# EAGLE design bttoken (EAGLE 6.4)
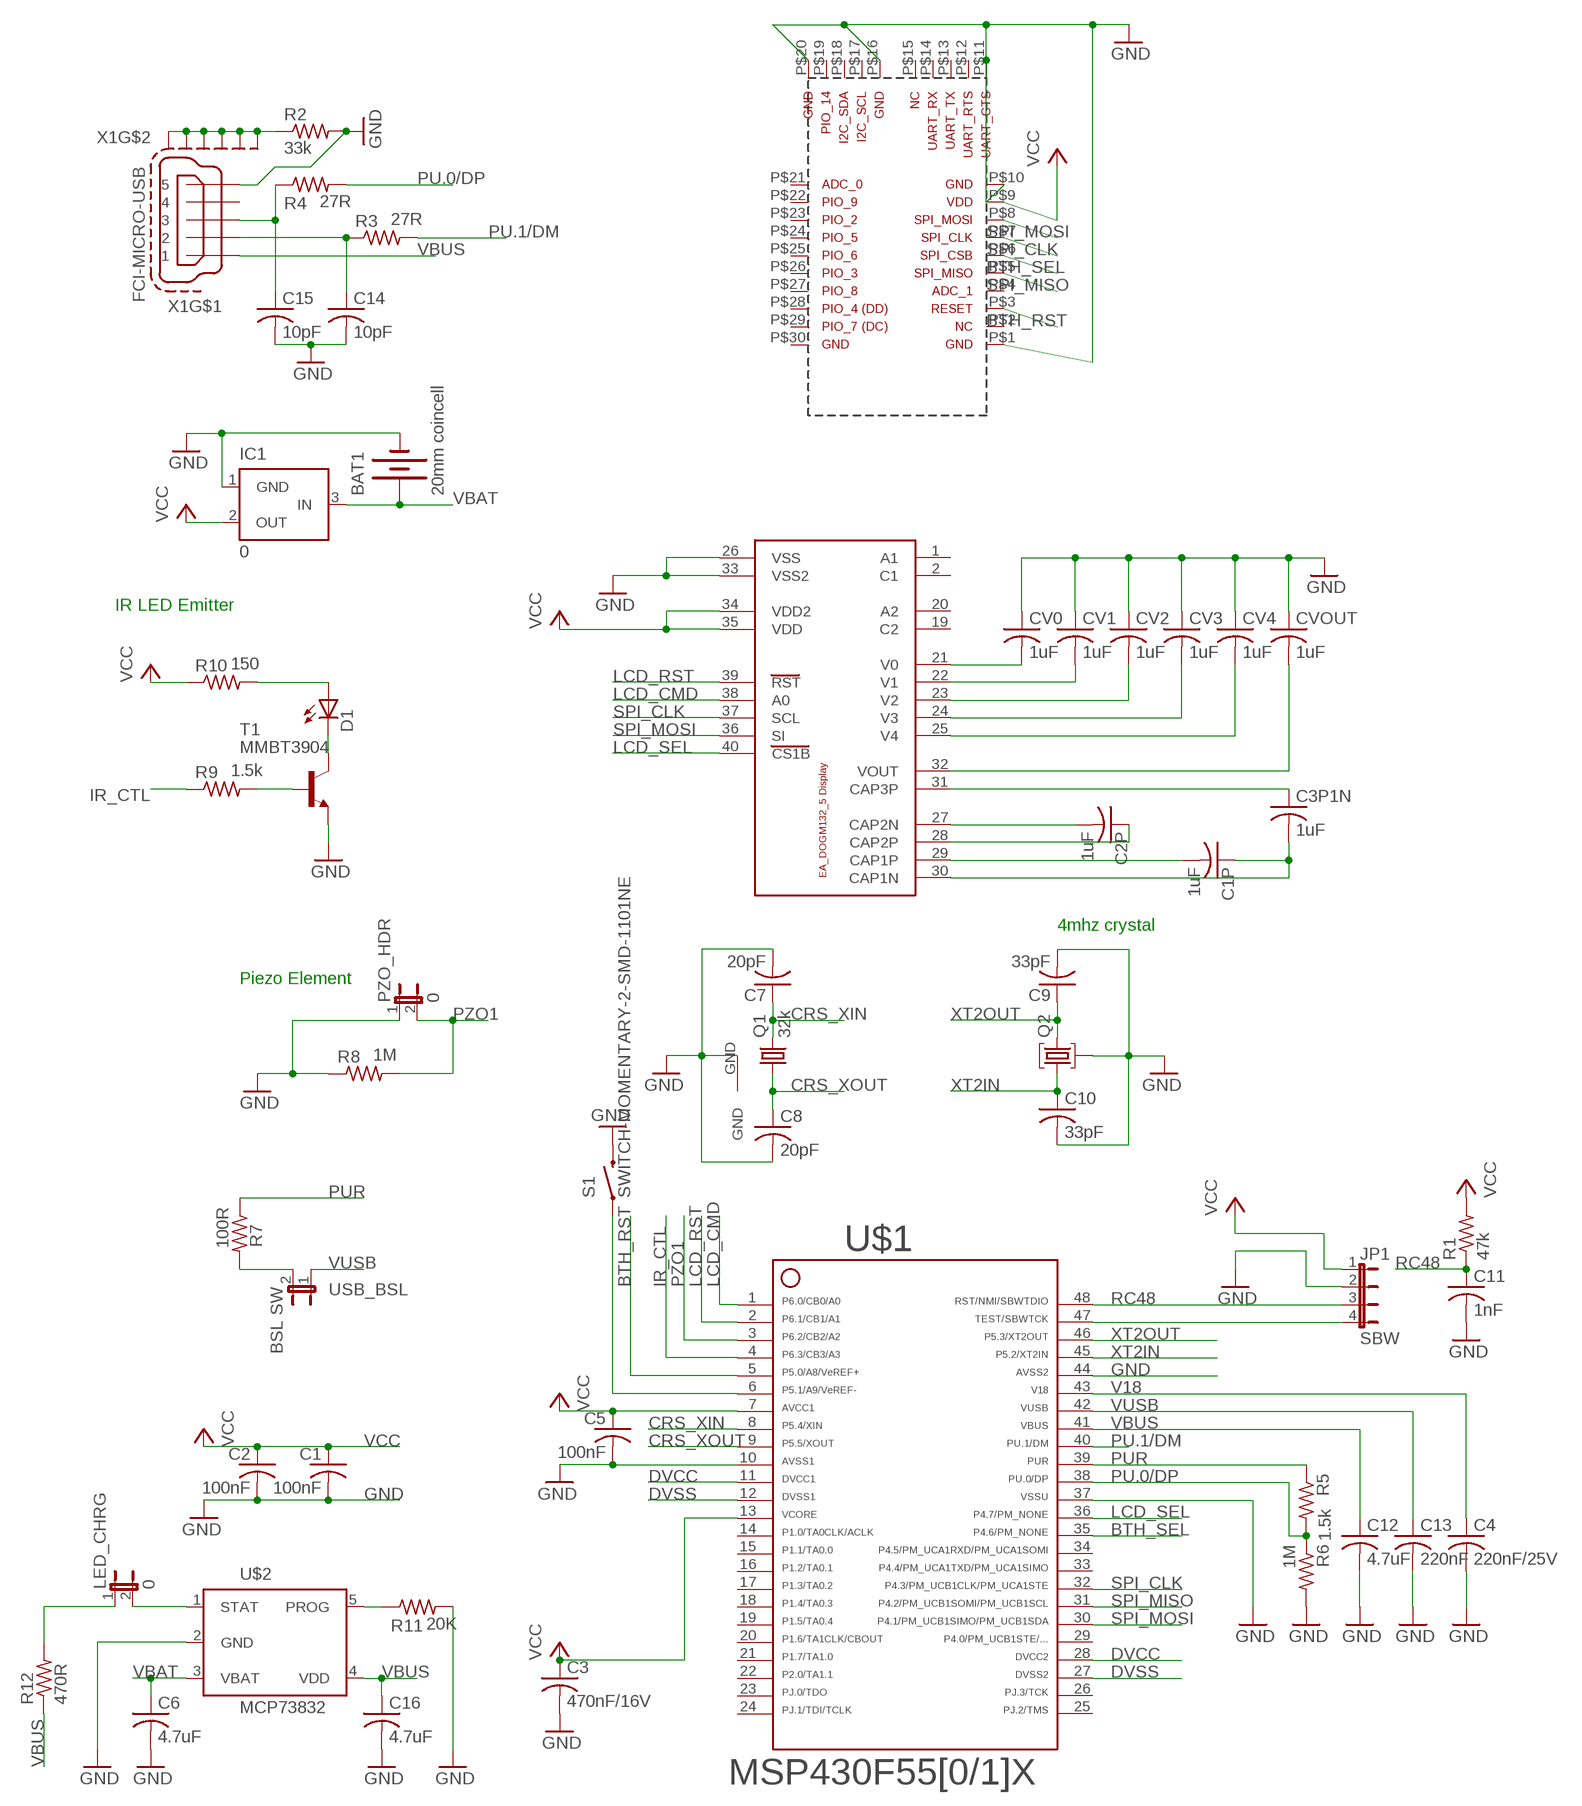
[diagram p0: schematic, sheet 1]

## Parts
BAT1  20mm coincell  BAT-HLD-001  [BAT-HLD-001]
C1  100nF  C-USC0805  [C0805]
C1P  1uF  C-USC0805  [C0805]
C2  100nF  C-USC0805  [C0805]
C2P  1uF  C-USC0805  [C0805]
C3  470nF/16V  C-USC0805  [C0805]
C3P1N  1uF  C-USC0805  [C0805]
C4  220nF/25V  C-USC0805  [C0805]
C5  100nF  C-USC0805  [C0805]
C6  4.7uF  C-USC0805  [C0805]
C7  20pF  C-USC0805  [C0805]
C8  20pF  C-USC0805  [C0805]
C9  33pF  C-USC0805  [C0805]
C10  33pF  C-USC0805  [C0805]
C11  1nF  C-USC0805  [C0805]
C12  4.7uF  C-USC0805  [C0805]
C13  220nF  C-USC0805  [C0805]
C14  10pF  C-USC0805  [C0805]
C15  10pF  C-USC0805  [C0805]
C16  4.7uF  C-USC0805  [C0805]
CV0  1uF  C-USC0805  [C0805]
CV1  1uF  C-USC0805  [C0805]
CV2  1uF  C-USC0805  [C0805]
CV3  1uF  C-USC0805  [C0805]
CV4  1uF  C-USC0805  [C0805]
CVOUT  1uF  C-USC0805  [C0805]
D1  SFH482  [SFH482]
IC1  0  MCP1700  [SOT23]
JP1  SBW  JMP4E  [JP4]
LED_CHRG  0  JP1E  [JP1]
PZO_HDR  0  JP1E  [JP1]
Q1  32k  TC47H-SMT  [TC26H-SMT]
Q2  10G7A-12.5KHZ  [HC49U]
R1  47k  R-US_R0805  [R0805]
R2  33k  R-US_R0805  [R0805]
R3  27R  R-US_R0805  [R0805]
R4  27R  R-US_R0805  [R0805]
R5  1.5k  R-US_R0805  [R0805]
R6  1M  R-US_R0805  [R0805]
R7  100R  R-US_R0805  [R0805]
R8  1M  R-US_R0805  [R0805]
R9  1.5k  R-US_R0805  [R0805]
R10  150  R-US_R0805  [R0805]
R11  20K  R-US_R0805  [R0805]
R12  470R  R-US_R0805  [R0805]
S1  SWITCH-MOMENTARY-2-SMD-1101NE  [TACTILE-SWITCH-1101NE]
T1  MMBT3904  MMBT3904LT1-NPN-SOT23-BEC  [SOT23-BEC]
U$1  F55[0/1]X---PT48  [PT48]
U$2  MCP73832  [SOT23-5]
U$11  DISPLAY_EA_DOGM132_EA_DOG-M_DISPLAY  [DISPLAY_EA_DOGM132_E_DOG-M_DISPLAY]
U$13  BR-LE4.0-S3-NC  [BR-LE4.0-X2A-NC]
USB_BSL  BSL SW  JP1E  [JP1]
X1  FCI-MICRO-USB  [FCI-MICRO-USB5]

## Nets
BTH_RST: U$1.5 U$13.P$3
BTH_SEL: U$1.35 U$13.P$6
CRS_XIN: C7.1 Q1.2 U$1.8
CRS_XOUT: C8.1 Q1.1 U$1.9
DVCC: U$1.11 U$1.28
DVSS: U$1.12 U$1.27
GND: BAT1.P$1-(-) C1.2 C2.2 C3.2 C4.2 C5.2 C6.2 C7.2 C8.2 C9.2 C10.2 C11.2 C12.2 C13.2 C14.2 C15.2 C16.2 CV0.1 CV1.1 CV2.1 CV3.1 CV4.1 CVOUT.1 IC1.1(GND) JP1.2 PZO_HDR.1 Q1.GND Q2.2 R2.2 R6.2 R8.1 R11.2 S1.P$2 T1.E U$1.10 U$1.37 U$1.44 U$2.2(GND) U$11.26(VSS) U$11.33(VSS2) U$13.P$1 U$13.P$10 U$13.P$11 U$13.P$16 U$13.P$20 X1.5
IR_CTL: R9.1 U$1.4
LCD_CMD: U$1.1 U$11.38(A0)
LCD_RST: U$1.2 U$11.39(RST)
LCD_SEL: U$1.36 U$11.40(CS1B)
N$1: R2.1 X1.M1(S1) X1.M2(S2) X1.M3(S3) X1.M4(S4) X1.M5(S5) X1.M6(S6)
N$2: R11.1 U$2.5(PROG)
N$3: LED_CHRG.2 U$2.1(STAT)
N$4: LED_CHRG.1 R12.2
N$5: D1.A R10.2
N$7: JP1.4 U$1.47
N$9: C14.1 R3.1 X1.2
N$10: R7.2 USB_BSL.2
N$11: CV1.2 U$11.22(V1)
N$12: R9.2 T1.B
N$13: C15.1 R4.1 X1.3
N$14: S1.P$1 U$1.6
N$15: D1.K(C) T1.C
N$16: CV2.2 U$11.23(V2)
N$17: CV3.2 U$11.24(V3)
N$18: CV4.2 U$11.25(V4)
N$19: CVOUT.2 U$11.32(VOUT)
N$21: C3P1N.1 U$11.31(CAP3P)
N$25: CV0.2 U$11.21(V0)
N$42: C2P.2 U$11.27(CAP2N)
N$43: C2P.1 U$11.28(CAP2P)
N$44: C1P.2 U$11.29(CAP1P)
N$45: C1P.1 C3P1N.2 U$11.30(CAP1N)
PU.0/DP: R4.2 R5.2 R6.1 U$1.38
PU.1/DM: R3.2 U$1.40
PUR: R5.1 R7.1 U$1.39
PZO1: PZO_HDR.2 R8.2 U$1.3
RC48: C11.1 JP1.3 R1.1 U$1.48
SPI_CLK: U$1.32 U$11.37(SCL) U$13.P$7
SPI_MISO: U$1.31 U$13.P$5
SPI_MOSI: U$1.30 U$11.36(SI) U$13.P$8
V18: C4.1 U$1.43
VBAT: BAT1.P$2+(+) BAT1.P$3+(+) C6.1 IC1.3(IN) U$2.3(VBAT)
VBUS: C12.1 C16.1 R12.1 U$1.41 U$2.4(VDD) X1.1
VCC: C1.1 C2.1 C3.1 C5.1 IC1.2(OUT) JP1.1 R1.2 R10.1 U$1.7 U$1.13 U$11.34(VDD2) U$11.35(VDD) U$13.P$9
VUSB: C13.1 U$1.42 USB_BSL.1
XT2IN: C10.1 Q2.1 U$1.45
XT2OUT: C9.1 Q2.3 U$1.46
Unconnected: U$1.14 U$1.15 U$1.16 U$1.17 U$1.18 U$1.19 U$1.20 U$1.21 U$1.22 U$1.23 U$1.24 U$1.25 U$1.26 U$1.29 U$1.33 U$1.34 U$11.1(A1) U$11.2(C1) U$11.19(C2) U$11.20(A2) U$13.P$2 U$13.P$4 U$13.P$12 U$13.P$13 U$13.P$14 U$13.P$15 U$13.P$17 U$13.P$18 U$13.P$19 U$13.P$21 U$13.P$22 U$13.P$23 U$13.P$24 U$13.P$25 U$13.P$26 U$13.P$27 U$13.P$28 U$13.P$29 U$13.P$30 X1.4

## Notes on the sheet
- IR LED Emitter
- 4mhz crystal
- Piezo Element

## Library data of the parts
BAT1 = DonB:BAT-HLD-001: Linx CR2025 CR2032 surface mount battery holder.
C1 C1P C2 C2P C3 C3P1N C4-C16 CV0 CV1-CV4 CVOUT = rcl:C-US: CAPACITOR, American symbol
D1 = led:SFH482: IR LED infrared emitting diode, Infineon
IC1 = DonB:MCP1700: Maxim 1700 Surface Mount Voltage Regulator SOT23-3
JP1 = DonB:JMP4E: Four pin jumper without pin numbers.
LED_CHRG PZO_HDR USB_BSL = jumper:JP1E: JUMPER
Q1 = DonB:TC47H-SMT
Q2 = crystal:10G: Monolithic Crystal Filters Source: www.golledge.com; OC_FARNELL: unknown; OC_NEWARK: unknown
R1-R12 = rcl:R-US_: RESISTOR, American symbol
S1 = SparkFun-Electromechanical:SWITCH-MOMENTARY-2: Various NO switches- pushbuttons, reed, etc
T1 = transistor:*-NPN-: NPN Transistror BF959 corrected 2008.03.06
U$1 = TI_MSP430_v16:F55[0/1]X---PT48: ***F55[0/1/2]X*** PT48 Rev. 1.0 06/2010 "http://www.ti.com/lit/gpn/msp430f5509" Only for FF5504, F5508,F5509,F5510
U$2 = DonB:MCP73832: Lithium Coin Cell Charge Controller
U$11 = dogm132_shield:DISPLAY_EA_DOGM132_EA_DOG-M_DISPLAY
U$13 = BlueRadios_D2_S2_C46_Eagle_footprint:BR-LE4.0-S3-NC: Bluetooth module with disconnected test pads.
X1 = DonB:FCI-MICRO-USB: FCI Industries 10118192-0001LF Micro USB Type B Female SMT connector

## Board
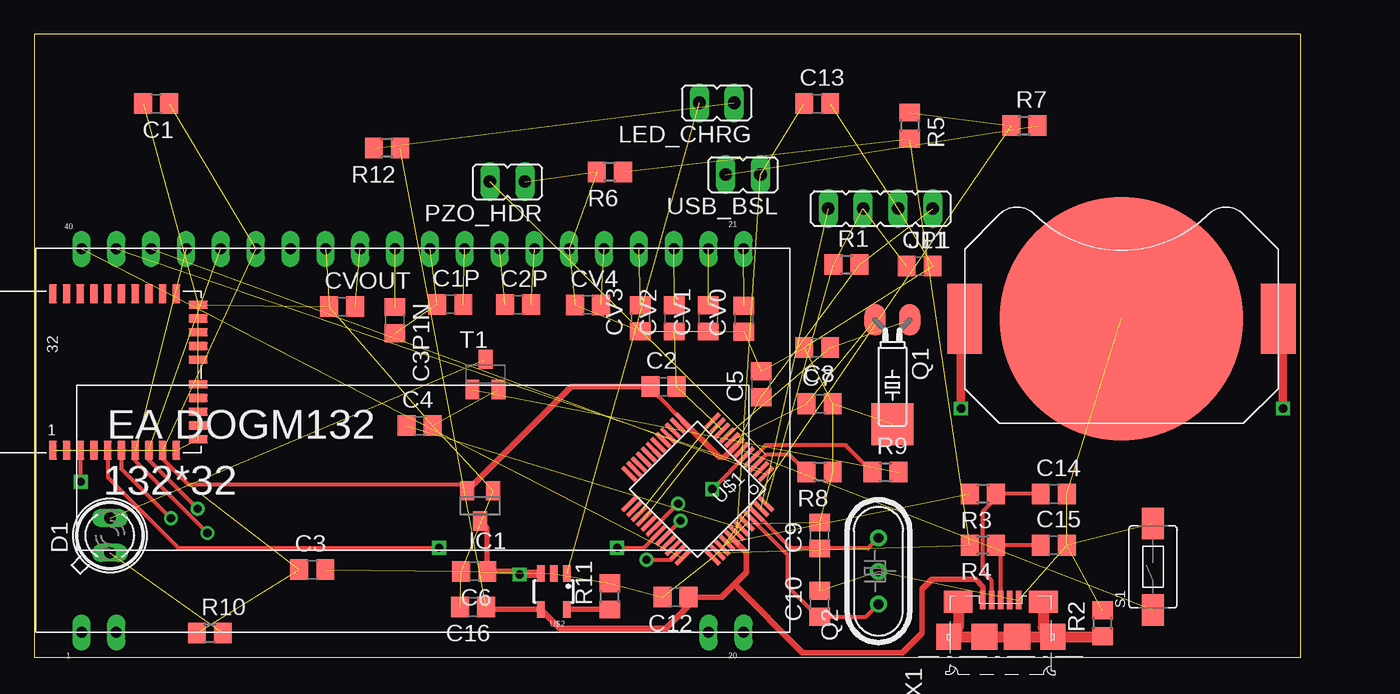
[diagram p1: board, top side]
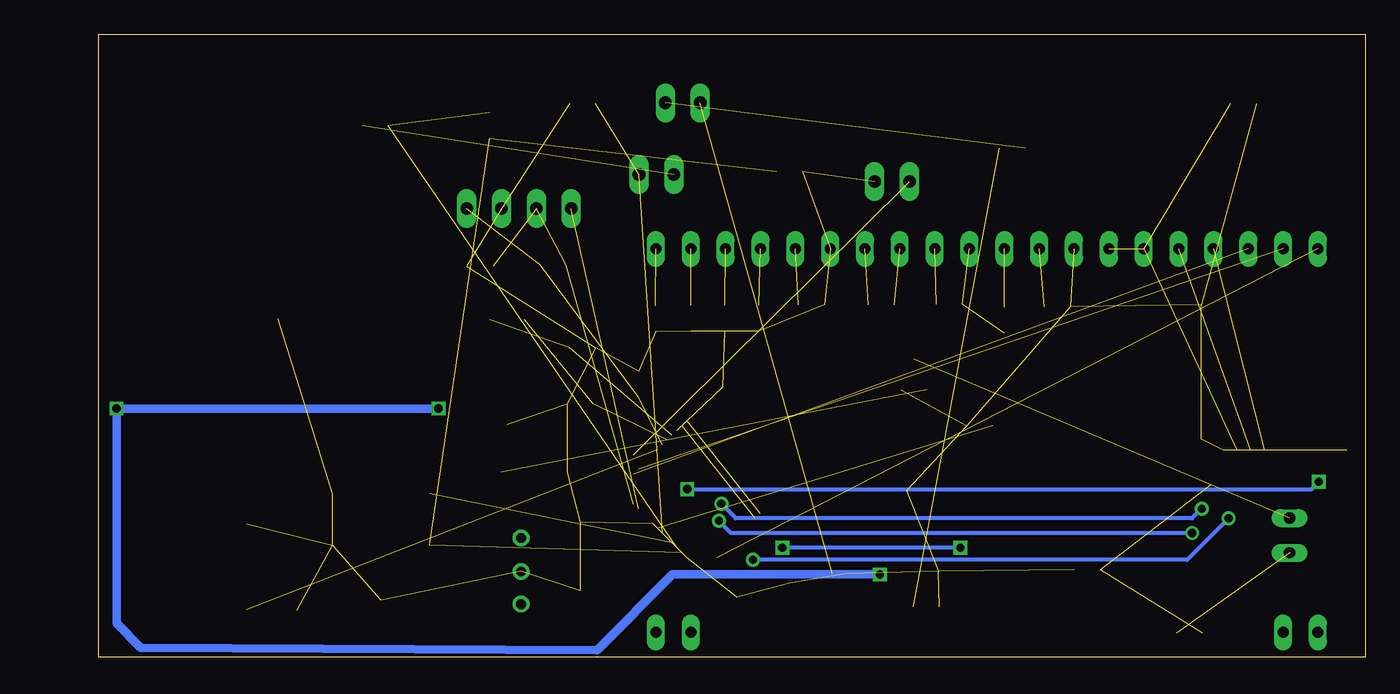
[diagram p2: board, bottom side, seen from below]

Size 92.32 x 45.41 mm. Coordinates in mm from the lower left corner, seen from the top.
Outline: 0,0 92.32,0 92.32,45.41 0,45.41 0,0
Copper layers (1*16): Top 0.035mm / dielectric 1.5mm / Bottom 0.035mm
Design rules "default": minimum track width 10mil, minimum drill 24mil, track to track 8mil, track to pad 8mil, pad to pad 8mil, via to via 8mil, smd to smd 8mil, copper to edge 40mil, drill to drill 8mil, minimum pad ring 10mil, minimum via ring 8mil, stop-mask expansion 4mil, vias tented up to drill 0mil, thermal gap 10mil

### Footprints (pad centres in the part's own frame; a part is rotated, then mirrored left to right if it is on the bottom)
BAT-HLD-001 = smd 17.78 x 17.78: P$1- 0,0 | smd 2.54 x 5.08: P$2+ -11.43,0; P$3+ 11.43,0
C0805 = smd 1.3 x 1.5: 1 -0.95,0; 2 0.95,0
SFH482 = drill 0.813 long: A -1.27,0; K 1.27,0
SOT23 = smd 1 x 1.4: 1 -0.95,-1.1; 2 0.95,-1.1; 3 0,1.1
JP4 = drill 0.914 long: 1 -3.81,0; 2 -1.27,0; 3 1.27,0; 4 3.81,0
JP1 = drill 0.914 long: 1 0,-1.27; 2 0,1.27
TC26H-SMT = smd 1.524 x 2.286: 1 -1.27,0; 2 1.27,0 | smd 3.048 x 3.048: GND 0,7.62
HC49U = drill 0.7 pad 1.2: 1 -2.413,0; 2 -0.027,0; 3 2.413,0
R0805 = smd 1.3 x 1.5: 1 -0.95,0; 2 0.95,0
TACTILE-SWITCH-1101NE = smd 2.3 x 1.6: P$1 -3.15,0; P$2 3.15,0
SOT23-BEC = smd 1 x 1.4: B -0.95,-1.1; C 0,1.1; E 0.95,-1.1
PT48 = smd 1.4 x 0.3: 1 -4.3,2.75; 2 -4.3,2.25; 3 -4.3,1.75; 4 -4.3,1.25; 5 -4.3,0.75; 6 -4.3,0.25; 7 -4.3,-0.25; 8 -4.3,-0.75; 9 -4.3,-1.25; 10 -4.3,-1.75; 11 -4.3,-2.25; 12 -4.3,-2.75; 25 4.3,-2.75; 26 4.3,-2.25; 27 4.3,-1.75; 28 4.3,-1.25; 29 4.3,-0.75; 30 4.3,-0.25; 31 4.3,0.25; 32 4.3,0.75; 33 4.3,1.25; 34 4.3,1.75; 35 4.3,2.25; 36 4.3,2.75 | smd 0.3 x 1.4: 13 -2.75,-4.3; 14 -2.25,-4.3; 15 -1.75,-4.3; 16 -1.25,-4.3; 17 -0.75,-4.3; 18 -0.25,-4.3; 19 0.25,-4.3; 20 0.75,-4.3; 21 1.25,-4.3; 22 1.75,-4.3; 23 2.25,-4.3; 24 2.75,-4.3; 37 2.75,4.3; 38 2.25,4.3; 39 1.75,4.3; 40 1.25,4.3; 41 0.75,4.3; 42 0.25,4.3; 43 -0.25,4.3; 44 -0.75,4.3; 45 -1.25,4.3; 46 -1.75,4.3; 47 -2.25,4.3; 48 -2.75,4.3
SOT23-5 = smd 1.2 x 0.55: 1 -1.3,0.95; 2 -1.3,0; 3 -1.3,-0.95; 4 1.3,-0.95; 5 1.3,0.95
DISPLAY_EA_DOGM132_E_DOG-M_DISPLAY = drill 0.8 long: 1 3.334,0; 2 5.874,0; 19 49.054,0; 20 51.594,0; 21 51.594,27.94; 22 49.054,27.94; 23 46.514,27.94; 24 43.974,27.94; 25 41.434,27.94; 26 38.894,27.94; 27 36.354,27.94; 28 33.814,27.94; 29 31.274,27.94; 30 28.734,27.94; 31 26.194,27.94; 32 23.654,27.94; 33 21.114,27.94; 34 18.574,27.94; 35 16.034,27.94; 36 13.494,27.94; 37 10.954,27.94; 38 8.414,27.94; 39 5.874,27.94; 40 3.334,27.94
BR-LE4.0-X2A-NC = smd 0.6 x 1.4: P$1 -3.27,-5.7; P$2 -2.27,-5.7; P$3 -1.27,-5.7; P$4 -0.27,-5.7; P$5 0.73,-5.7; P$6 1.73,-5.7; P$7 2.73,-5.7; P$8 3.73,-5.7; P$9 4.73,-5.7; P$10 5.73,-5.7; P$21 5.73,5.7; P$22 4.73,5.7; P$23 3.73,5.7; P$24 2.73,5.7; P$25 1.73,5.7; P$26 0.73,5.7; P$27 -0.27,5.7; P$28 -1.27,5.7; P$29 -2.27,5.7; P$30 -3.27,5.7 | smd 1.4 x 0.6: P$11 7.33,-4.9; P$12 7.33,-3.9; P$13 7.33,-2.9; P$14 7.33,-1.9; P$15 7.33,-0.9; P$16 7.33,0.9; P$17 7.33,1.9; P$18 7.33,2.9; P$19 7.33,3.9; P$20 7.33,4.9
FCI-MICRO-USB5 = smd 1.35 x 0.4: 1 2.675,1.3; 2 2.675,0.65; 3 2.675,0; 4 2.675,-0.65; 5 2.675,-1.3 | smd 1.9 x 1.9: M1 0,-1.2; M2 0,1.2 | smd 1.9 x 1.8: M3 0,3.8; M4 0,-3.8 | smd 1.6 x 2.1: M5 2.55,3.1; M6 2.55,-3.1

### Placement (x,y rotation side)
BAT1  79.26,24.68 180 top
C1  8.89,40.36 180 top
C1P  30.32,25.73 0 top
C2  45.87,19.74 0 top
C2P  35.28,25.71 0 top
C3  20.27,6.4 0 top
C3P1N  26.29,24.58 270 top
C4  28.09,16.89 0 top
C5  52.98,19.91 90 top
C6  32.08,6.28 180 top
C7  57.25,18.49 0 top
C8  57.07,22.58 180 top
C9  57.25,8.89 90 top
C10  57.25,3.91 90 top
C11  64.55,28.52 0 top
C12  46.74,4.4 180 top
C13  57.07,40.36 0 top
C14  74.32,11.91 0 top
C15  74.32,8.18 0 top
C16  31.99,3.68 180 top
CV0  51.73,24.67 90 top
CV1  49.13,24.71 90 top
CV2  46.66,24.71 90 top
CV3  44.19,24.72 90 top
CV4  40.37,25.7 0 top
CVOUT  22.44,25.56 0 top
D1  5.51,8.89 90 top
IC1  32.5,11.04 180 top
JP1  61.7,32.72 180 top
LED_CHRG  49.76,40.42 90 top
PZO_HDR  34.49,34.67 90 top
Q1  62.56,24.61 180 top
Q2  61.54,6.29 90 top
R1  59.21,28.63 0 top
R2  77.88,2.49 90 top
R3  69.16,11.91 180 top
R4  69.16,8.18 180 top
R5  63.83,38.76 270 top
R6  41.96,35.38 180 top
R7  72.19,38.76 0 top
R8  57.25,13.51 180 top
R9  62.05,13.51 0 top
R10  12.8,1.78 0 top
R11  41.96,4.45 90 top
R12  25.71,37.12 180 top
S1  81.56,6.61 90 top
T1  32.89,20.62 0 top
U$1  48.36,12.27 225 top
U$2  37.87,4.8 270 top
U$11  0.11,1.83 0 top
U$13  4.62,20.8 0 top
USB_BSL  51.67,35.19 90 top
X1  70.45,1.5 90 top

### Tracks (layer width: path | path; a pad name or v marks a point on that pad's centre or on a via)
BTH_RST  (via drill 0.6)
  Top 0.305: U$1.5 v49.43,12.27 | v3.38,12.8 3.38,15.08 U$13.P$3
  Bottom 0.305: v49.43,12.27 3.91,12.27 v3.38,12.8
BTH_SEL  (via drill 0.6)
  Top 0.305: U$13.P$6 6.35,13.74 v9.96,10.13 | v44.63,7.11 46.39,7.11 U$1.35
  Bottom 0.305: v9.96,10.13 12.98,7.11 v44.63,7.11
CRS_XIN  (2 unrouted)
CRS_XOUT  (2 unrouted)
DVCC  (1 unrouted)
DVSS  (1 unrouted)
GND  (45 unrouted)
IR_CTL
  Top 0.305: R9.1 59.15,15.47 53.33,15.47 U$1.4
LCD_CMD  (1 unrouted)
LCD_RST  (1 unrouted)
LCD_SEL  (1 unrouted)
N$1
  Top 0.813: X1.M4 77.84,1.5 R2.1 | X1.M5 67.36,2.2 X1.M3 X1.M2 X1.M1 X1.M4 | X1.M6 73.56,2.2 X1.M4
N$2
  Top 0.406: U$2.5 R11.1
N$3  (1 unrouted)
N$4  (1 unrouted)
N$5  (1 unrouted)
N$7  (1 unrouted)
N$9
  Top 0.305: X1.2 69.81,5.58 69.16,6.22 69.16,10.67 69.88,11.38 69.88,11.67 R3.1 C14.1
N$10  (1 unrouted)
N$11  (1 unrouted)
N$12  (1 unrouted)
N$13
  Top 0.305: X1.3 70.45,7.84 R4.1 C15.1
N$14  (1 unrouted)
N$15  (1 unrouted)
N$16  (1 unrouted)
N$17  (1 unrouted)
N$18  (1 unrouted)
N$19  (1 unrouted)
N$21  (1 unrouted)
N$25  (1 unrouted)
N$42  (1 unrouted)
N$43  (1 unrouted)
N$44  (1 unrouted)
N$45  (2 unrouted)
PU.0/DP  (3 unrouted)
PU.1/DM  (1 unrouted)
PUR  (2 unrouted)
PZO1  (1 unrouted)
  Top 0.305: R8.2 55.06,14.76 53.33,14.76 U$1.3
RC48  (3 unrouted)
SPI_CLK  (via drill 0.6)  (1 unrouted)
  Top 0.305: U$13.P$7 7.35,14.34 v12.62,9.07 | v47.12,9.96 v47.11,9.96 U$1.32
  Bottom 0.305: v12.62,9.07 46.23,9.07 v47.12,9.96
SPI_MISO  (via drill 0.6)
  Top 0.305: U$13.P$5 5.35,13.14 10.49,8 v29.52,8 | v42.49,8 44.45,8 U$1.31
  Bottom 0.305: v29.52,8 v42.49,8
SPI_MOSI  (via drill 0.6)  (1 unrouted)
  Top 0.305: U$13.P$8 8.35,14.41 v11.91,10.85 | v46.94,11.2 U$1.30
  Bottom 0.305: v11.91,10.85 12.62,10.13 45.87,10.13 v46.94,11.2
V18  (1 unrouted)
VBAT  (via drill 0.6)
  Top 0.406: v35.38,6.04 35.15,6.28 C6.1 33.03,9.42 IC1.3
  Top 0.61: U$2.3 35.33,6.1 v35.38,6.04 | v91.03,18.14 91.03,24.18 90.69,24.53 BAT1.P$2+ | BAT1.P$3+ 67.56,24.41 v67.56,18.14
  Bottom 0.61: v35.38,6.04 50.49,6.04 56.01,0.53 89.26,0.71 91.03,2.49 v91.03,18.14 v67.56,18.14
VBUS  (1 unrouted)
  Top 0.406: C16.1 33.12,3.5 U$2.4 38.29,2.13 46.05,2.13 47.69,3.78 C12.1 50.09,4.4 51.03,5.33 | 51.03,5.33 51.92,6.22 51.92,7.64 U$1.41 | X1.1 69.16,5.17 68.63,5.69 65.43,5.69 64.72,4.98 64.72,1.78 63.3,0.36 56.01,0.36 51.03,5.33
VCC  (8 unrouted)
  Top 0.305: U$1.13 45.49,19.02 C2.1 | U$13.P$9 9.35,14.47 11.2,12.62 31.07,12.62 IC1.2
  Top 0.406: IC1.2 39.15,19.74 C2.1 | U$1.13 49.94,14.58 50.32,14.58 U$1.7
VUSB  (2 unrouted)
XT2IN
  Top 0.305: U$1.45 54.94,7.46 54.94,5.16 57.13,2.96 C10.1 60.62,2.96 Q2.1
XT2OUT
  Top 0.305: Q2.3 60.78,7.94 C9.1 55.16,7.94 U$1.46